# Altium project PCB_Motor_driver.PrjPcb
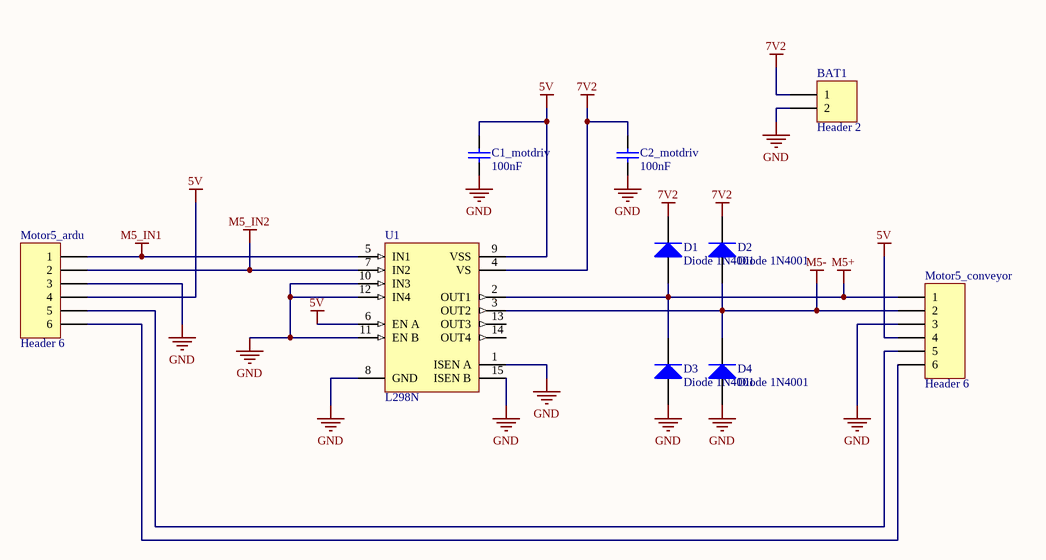
[diagram p0: Motor_driver.SchDoc]
1 sheet, 10 parts. Net scope: global (net labels, ports and power ports of the same name join across sheets).
Board file: motor_driver.PcbDoc

## Sheet Motor_driver.SchDoc
size A4; Organization: EPFL; DocumentNumber: 1; Revision: 1; SheetNumber: 1; SheetTotal: 1

### Parts
BAT1  Header 2  [STL1550/2-3.5]
C1_motdriv  100nF  [CAPC1608N]
C2_motdriv  100nF  [CAPC1608N]
D1  Diode 1N4001  [DO-41]
D2  Diode 1N4001  [DO-41]
D3  Diode 1N4001  [DO-41]
D4  Diode 1N4001  [DO-41]
Motor5_ardu  Header 6  [HDR1X6]
Motor5_conveyor  Header 6  [HDR1X6]
U1  L298N  [MULTIWAT15]

### Nets
5V: C1_motdriv.2 Motor5_ardu.4 Motor5_conveyor.4 U1.6(EN_A) U1.9(VSS)
7V2: BAT1.1 C2_motdriv.2 D1.2(K) D2.2(K) U1.4(VS)
GND: BAT1.2 C1_motdriv.1 C2_motdriv.1 D3.1(A) D4.1(A) Motor5_ardu.3 Motor5_conveyor.3 U1.1(ISEN_A) U1.8(GND) U1.10(IN3) U1.11(EN_B) U1.12(IN4) U1.15(ISEN_B)
M5+: D1.1(A) D3.2(K) Motor5_conveyor.1 U1.2(OUT1)
M5-: D2.1(A) D4.2(K) Motor5_conveyor.2 U1.3(OUT2)
M5_IN1: Motor5_ardu.1 U1.5(IN1)
M5_IN2: Motor5_ardu.2 U1.7(IN2)
NetMotor5_ardu_5: Motor5_ardu.5 Motor5_conveyor.5
NetMotor5_ardu_6: Motor5_ardu.6 Motor5_conveyor.6

Not connected (* = marked no-connect by the designer): U1 13(OUT3) 14(OUT4)

### Notes on the sheet
- Title
- Size:
- Date:
- A4
- Number:
- Time:
- Revision:
- Sheet
- of
- File:

### Library data of the parts
BAT1 = Header 2: Header, 2-Pin; LatestRevisionDate: 17-Jul-2002; LatestRevisionNote: Re-released for DXP Platform.; Publisher: Altium Limited
C1_motdriv C2_motdriv = Cap: Capacitor; Published: 8-Jun-2000; LatestRevisionDate: 17-Jul-2002; LatestRevisionNote: Re-released for DXP Platform.; PackageReference: RAD-0.3; Publisher: Altium Limited; PackageDescription: Radial Cap, Thru-Hole; 2 Leads; 0.3 in Pin Spacing
D1-D4 = Diode 1N4001: 1 Amp General Purpose Rectifier; Published: 8-Jun-2000; LatestRevisionDate: 17-Jul-2002; LatestRevisionNote: Re-released for DXP Platform.; DatasheetVersion: 1998; PackageVersion: Aug-1999; PackageReference: DO-41; Publisher: Altium Limited; PackageDescription: Diode, Axial; Body 5.2 x 2.7 mm (LxDia. max), Lead Dia. 0.86 mm (max); Code_JEDEC: DO-204-AL; ComponentLink1Description: Manufacturer Link; ComponentLink1URL: http://www.fairchildsemi.com/; ComponentLink2Description: Datasheet; ComponentLink2URL: http://www.fairchildsemi.com/ds/1N%2F1N4001.pdf
Motor5_ardu Motor5_conveyor = Header 6: Header, 6-Pin; LatestRevisionDate: 17-Jul-2002; LatestRevisionNote: Re-released for DXP Platform.; Publisher: Altium Limited
U1 = L298N: Dual Full Bridge Driver; Published: 8-Jun-2000; LatestRevisionDate: 14-May-2007; LatestRevisionNote: Mapped to vertical PCB.; DatasheetVersion: Jul-1999; PackageReference: Multiwatt15V; Publisher: Altium Limited; PackageDescription: TO, Thru-Hole, Vertical, Heatsink Mounted; 15 Bent Staggered Leads; Pitch 1.27 mm; ComponentLink1Description: Manufacturer Link; ComponentLink1URL: http://www.st.com/; ComponentLink2Description: Datasheet; ComponentLink2URL: http://www.st.com/stonline/products/literature/ds/1773/l298.pdf